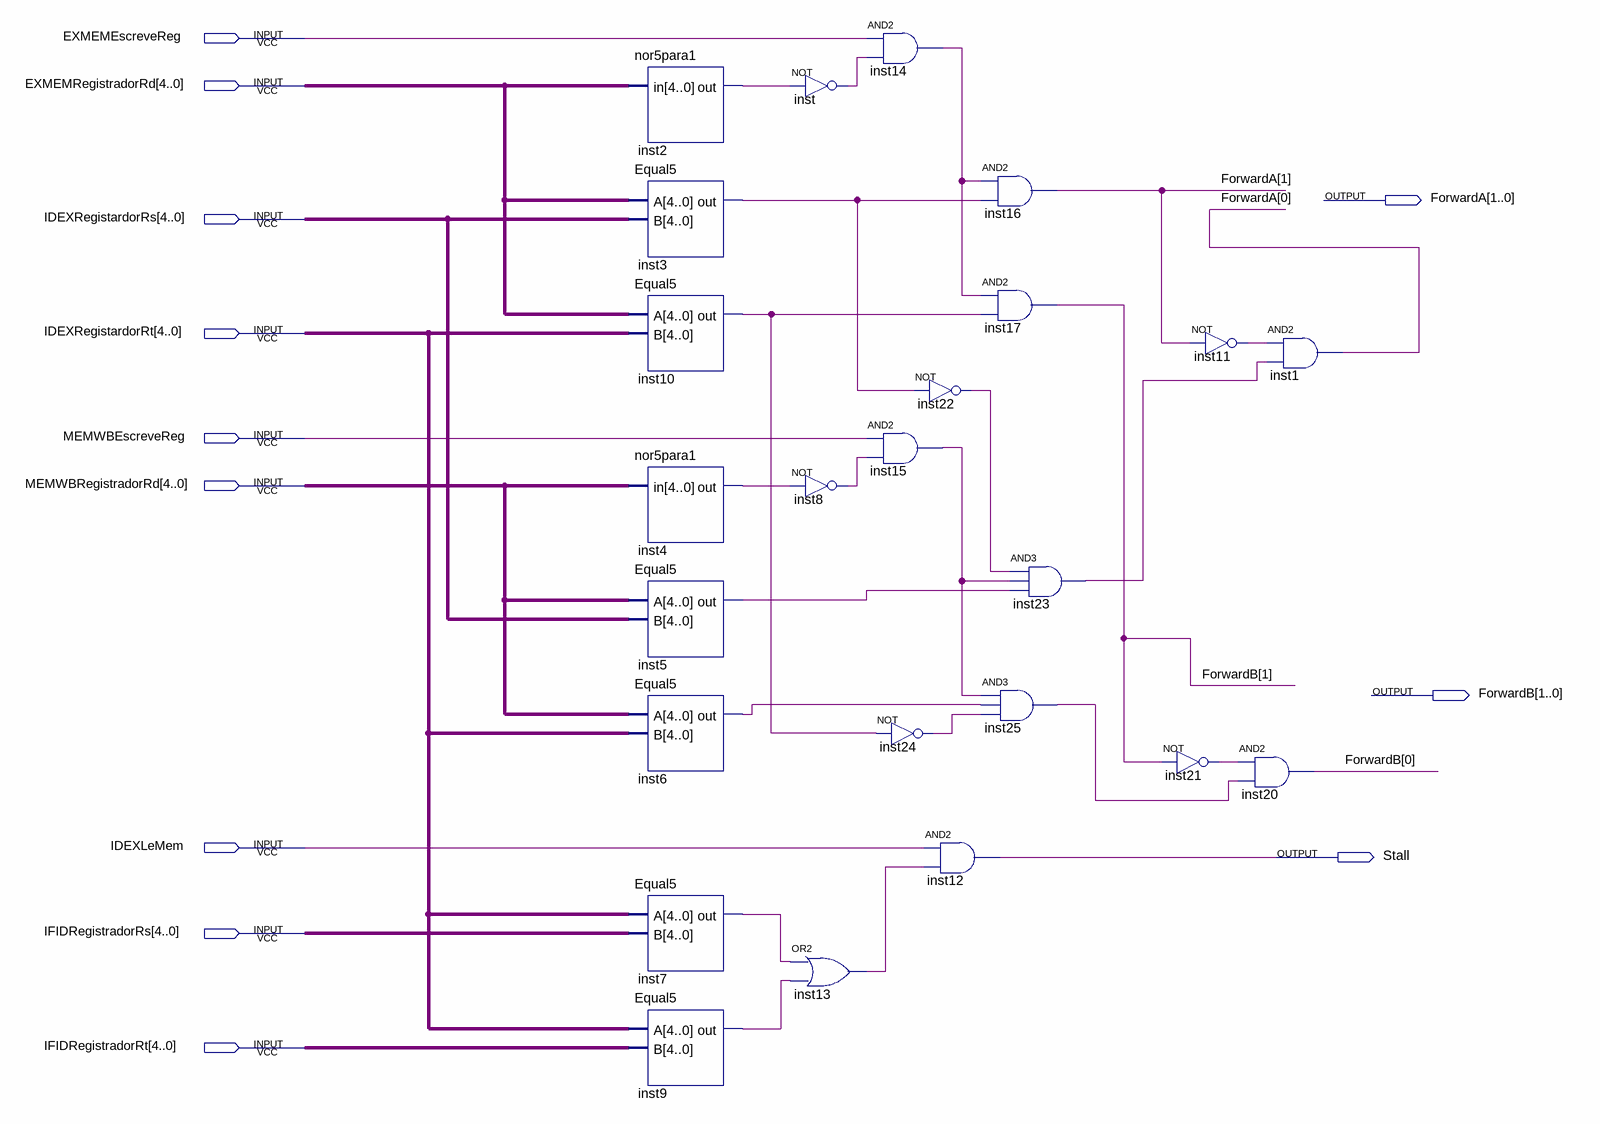
[diagram p0: schematic sheet]
// Quartus schematic Hazard.bdf as structural Verilog: 24 symbols, 12 pins
module Hazard (
  input  EXMEMEscreveReg,
  input  [4:0] EXMEMRegistradorRd,
  input  [4:0] IDEXRegistardorRs,
  input  [4:0] IDEXRegistardorRt,
  input  MEMWBEscreveReg,
  input  [4:0] MEMWBRegistradorRd,
  input  IDEXLeMem,
  input  [4:0] IFIDRegistradorRs,
  input  [4:0] IFIDRegistradorRt,
  output [1:0] ForwardA,
  output [1:0] ForwardB,
  output Stall
);

  wire inst2_out, inst3_out, inst4_out, inst5_out, inst6_out, inst7_out, inst8_out, inst9_out, inst10_out,
       inst11_out, inst13_out, inst14_out, inst15_out, inst21_out, inst22_out, inst23_out, inst24_out,
       inst25_out, inst_out;

  nor5para1 inst2 (.in(EXMEMRegistradorRd), .out(inst2_out));
  Equal5 inst3 (.A(EXMEMRegistradorRd), .B(IDEXRegistardorRs), .out(inst3_out));
  Equal5 inst10 (.A(EXMEMRegistradorRd), .B(IDEXRegistardorRt), .out(inst10_out));
  nor5para1 inst4 (.in(MEMWBRegistradorRd), .out(inst4_out));
  Equal5 inst5 (.A(MEMWBRegistradorRd), .B(IDEXRegistardorRs), .out(inst5_out));
  Equal5 inst6 (.A(MEMWBRegistradorRd), .B(IDEXRegistardorRt), .out(inst6_out));
  Equal5 inst7 (.A(IDEXRegistardorRt), .B(IFIDRegistradorRs), .out(inst7_out));
  Equal5 inst9 (.A(IDEXRegistardorRt), .B(IFIDRegistradorRt), .out(inst9_out));
  not inst (inst_out, inst2_out);
  not inst8 (inst8_out, inst4_out);
  or inst13 (inst13_out, inst7_out, inst9_out);
  and inst14 (inst14_out, EXMEMEscreveReg, inst_out);
  not inst22 (inst22_out, inst3_out);
  and inst15 (inst15_out, MEMWBEscreveReg, inst8_out);
  not inst24 (inst24_out, inst10_out);
  and inst12 (Stall, IDEXLeMem, inst13_out);
  and inst16 (ForwardA[1], inst14_out, inst3_out);
  and inst17 (ForwardB[1], inst14_out, inst10_out);
  and inst23 (inst23_out, inst22_out, inst15_out, inst5_out);
  and inst25 (inst25_out, inst15_out, inst6_out, inst24_out);
  not inst21 (inst21_out, ForwardB[1]);
  not inst11 (inst11_out, ForwardA[1]);
  and inst20 (ForwardB[0], inst21_out, inst25_out);
  and inst1 (ForwardA[0], inst11_out, inst23_out);
endmodule
